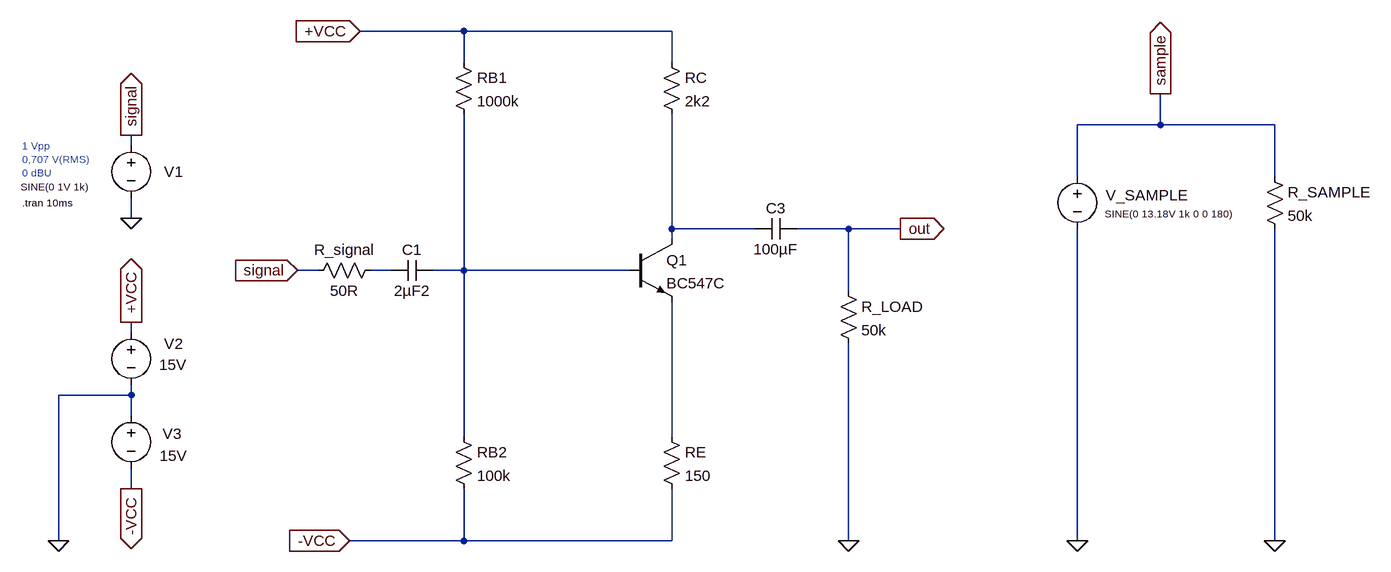
[diagram p0: schematic single-pre-amplifier.asc]
single-pre-amplifier.asc, the LTspice schematic file:
Version 4
SHEET 1 4360 680
WIRE 48 -400 -112 -400
WIRE 368 -400 48 -400
WIRE 48 -352 48 -400
WIRE 368 -352 368 -400
WIRE 1120 -256 1120 -304
WIRE 1120 -256 992 -256
WIRE 1296 -256 1120 -256
WIRE -464 -224 -464 -240
WIRE 992 -176 992 -256
WIRE 1296 -176 1296 -256
WIRE -464 -112 -464 -144
WIRE 368 -96 368 -272
WIRE 496 -96 368 -96
WIRE 640 -96 560 -96
WIRE 720 -96 640 -96
WIRE 368 -80 368 -96
WIRE -176 -32 -208 -32
WIRE -64 -32 -96 -32
WIRE 48 -32 48 -272
WIRE 48 -32 0 -32
WIRE 304 -32 48 -32
WIRE 640 0 640 -96
WIRE -464 64 -464 48
WIRE -464 160 -464 144
WIRE -464 160 -576 160
WIRE -464 192 -464 160
WIRE 48 224 48 -32
WIRE 368 224 368 16
WIRE -464 304 -464 272
WIRE -576 384 -576 160
WIRE 48 384 48 304
WIRE 48 384 -128 384
WIRE 368 384 368 304
WIRE 368 384 48 384
WIRE 640 384 640 80
WIRE 992 384 992 -96
WIRE 1296 384 1296 -96
FLAG -464 -112 0
FLAG -576 384 0
FLAG -464 48 +VCC
IOPIN -464 48 Out
FLAG -464 304 -VCC
IOPIN -464 304 Out
FLAG -464 -240 signal
IOPIN -464 -240 Out
FLAG -208 -32 signal
IOPIN -208 -32 In
FLAG -112 -400 +VCC
IOPIN -112 -400 In
FLAG -128 384 -VCC
IOPIN -128 384 In
FLAG 720 -96 out
IOPIN 720 -96 Out
FLAG 640 384 0
FLAG 992 384 0
FLAG 1296 384 0
FLAG 1120 -304 sample
IOPIN 1120 -304 Out
DATAFLAG 208 -32 ""
DATAFLAG 368 112 ""
DATAFLAG 368 -192 ""
SYMBOL voltage -464 -240 R0
WINDOW 0 51 56 Left 2
WINDOW 3 -170 79 Left 1
WINDOW 123 0 0 Left 0
WINDOW 39 0 0 Left 0
SYMATTR InstName V1
SYMATTR Value SINE(0 1V 1k)
SYMBOL voltage -464 48 R0
WINDOW 0 51 33 Left 2
WINDOW 3 43 65 Left 2
WINDOW 123 0 0 Left 0
WINDOW 39 0 0 Left 0
SYMATTR InstName V2
SYMATTR Value 15V
SYMBOL voltage -464 176 R0
WINDOW 0 48 43 Left 2
WINDOW 3 44 77 Left 2
WINDOW 123 0 0 Left 0
WINDOW 39 0 0 Left 0
SYMATTR InstName V3
SYMATTR Value 15V
SYMBOL npn 304 -80 R0
SYMATTR InstName Q1
SYMATTR Value BC547C
SYMBOL res 352 -368 R0
SYMATTR InstName RC
SYMATTR Value 2k2
SYMBOL res 32 -368 R0
SYMATTR InstName RB1
SYMATTR Value 1000k
SYMBOL res 32 208 R0
SYMATTR InstName RB2
SYMATTR Value 100k
SYMBOL res 624 -16 R0
SYMATTR InstName R_LOAD
SYMATTR Value 50k
SYMBOL cap 0 -48 R90
WINDOW 0 0 32 VBottom 2
WINDOW 3 32 32 VTop 2
SYMATTR InstName C1
SYMATTR Value 2µF2
SYMBOL res -80 -48 R90
WINDOW 0 0 56 VBottom 2
WINDOW 3 32 56 VTop 2
SYMATTR InstName R_signal
SYMATTR Value 50R
SYMBOL cap 560 -112 R90
WINDOW 0 0 32 VBottom 2
WINDOW 3 32 32 VTop 2
SYMATTR InstName C3
SYMATTR Value 100µF
SYMBOL res 352 208 R0
SYMATTR InstName RE
SYMATTR Value 150
SYMBOL voltage 992 -192 R0
WINDOW 0 44 44 Left 2
WINDOW 3 42 73 Left 1
WINDOW 123 0 0 Left 0
WINDOW 39 0 0 Left 0
SYMATTR InstName V_SAMPLE
SYMATTR Value SINE(0 13.18V 1k 0 0 180)
SYMBOL res 1280 -192 R0
SYMATTR InstName R_SAMPLE
SYMATTR Value 50k
TEXT -632 -136 Left 1 !.tran 10ms
TEXT -632 -224 Left 1 ;1 Vpp \n0,707 V(RMS) \n0 dBU

The netlist it stands for:
* single-pre-amplifier.asc
V1 signal 0 SINE(0 1V 1k)
V2 +VCC 0 15V
V3 0 -VCC 15V
Q1 N001 N003 N004 0 BC547C
RC +VCC N001 2k2
RB1 +VCC N003 1000k
RB2 N003 -VCC 100k
R_LOAD out 0 50k
C1 N003 N002 2µF2
R_signal N002 signal 50R
C3 out N001 100µF
RE N004 -VCC 150
V_SAMPLE sample 0 SINE(0 13.18V 1k 0 0 180)
R_SAMPLE sample 0 50k
.model NPN NPN
.model PNP PNP
.lib standard.bjt
.tran 10ms
* 1 Vpp
* 0,707 V(RMS)
* 0 dBU
.backanno
.end